# EasyEDA Pro project schematic.epro

# Schematic Occula Zero Control Board Teensy Rev 2
Board Name: Occula Zero Control Board Teensy Rev 2; Create Date: 2025-01-11; Page Name: P1; Project Name: Occula Zero Control Board v2; Schematic Name: Occula Zero Control Board Teensy Rev 2; Update Date: 2025-01-18; Company: EasyEDA.com; Page Size: A4; Version: V1.0
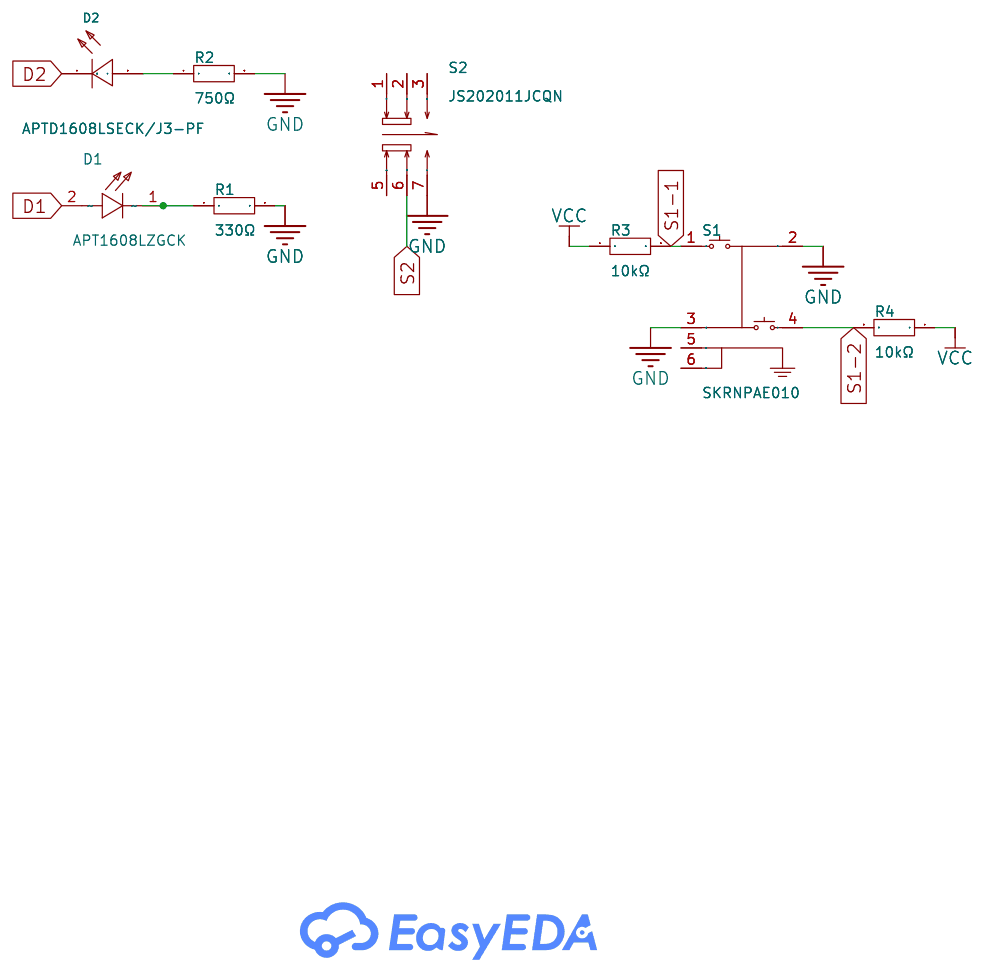
[diagram p0: schematic sheet]

## Parts
D1  APT1608LZGCK  [LED_APT1608LZGCK]
D2  APTD1608LSECK/J3-PF  [LED-SMD_L1.6-W0.8-RD]
R1  330Ω  [R0603]
R2  750Ω  [R0603]
R3  10kΩ  [R0603]
R4  10kΩ  [R0603]
S1  SKRNPAE010  [SW-SMD_6P-L6.0-W6.0-P4.50-LS6.4]
S2  JS202011JCQN  [SW-SMD_JS202011JCQN]

## Library data of the parts
D1 = APT1608LZGCK
D2 = APTD1608LSECK/J3-PF: Emitted Color:Red Forward Voltage (VF):1.8V Forward Voltage (VF):1.8V Forward Current:2mA Dominant Wavelength:625nm Dominant Wavelength:625nm Peak Wavelength:640nm Lens Color:无色透明透镜 Luminous Intensity:50mcd Luminous Intensity:50mcd Viewing Angle:60°; Supplier Part: C5879214; Manufacturer: Kingbright; Supplier Footprint: SMD,1.6x0.8mm; JLCPCB Part Class: Extended Part; Supplier: LCSC; Emitted Color: Red; Forward Voltage (VF): 1.8V; Forward Current: 2mA; Dominant Wavelength: 625nm; Peak Wavelength: 640nm; Lens Color: 无色透明透镜; Luminous Intensity: 50mcd; Viewing Angle: 60°
R1 = RC0603JR-07330RL: Type:Thick Film Resistors Resistance: Tolerance:±5% Tolerance:±5% Power(Watts): Overload Voltage (Max): Temperature Coefficient:±100ppm/℃ Temperature Coefficient:±100ppm/℃ Operating Temperature Range:-55℃~+155℃ Operating Temperature Range:-55℃~+155℃; LCSC Part Name: 厚膜电阻 330Ω ±5% 100mW; Supplier Part: C98220; Manufacturer: YAGEO(国巨); Supplier Footprint: 0603; JLCPCB Part Class: Extended Part; Datasheet: https://atta.szlcsc.com/upload/public/pdf/source/20170705/1499242708629.pdf; Supplier: LCSC; Type: Thick Film Resistors; Tolerance: ±5%; Temperature Coefficient: ±100ppm/℃; Operating Temperature Range: -55℃~+155℃
R2 = RC0603JR-07750RL: Type:Thick Film Resistors Resistance: Tolerance:±5% Tolerance:±5% Power(Watts): Overload Voltage (Max): Temperature Coefficient:±100ppm/℃ Temperature Coefficient:±100ppm/℃ Operating Temperature Range:-55℃~+155℃ Operating Temperature Range:-55℃~+155℃; LCSC Part Name: 厚膜电阻 750Ω ±5% 100mW; Supplier Part: C98220; Manufacturer: YAGEO(国巨); Supplier Footprint: 0603; JLCPCB Part Class: Extended Part; Datasheet: https://atta.szlcsc.com/upload/public/pdf/source/20180821/C275644_0D56F95EFF785E7D9A1FEF436B37DA78.pdf; Supplier: LCSC; Type: Thick Film Resistors; Tolerance: ±5%; Temperature Coefficient: ±100ppm/℃; Operating Temperature Range: -55℃~+155℃
R3 R4 = RC0603FR-0710KL: Type:Thick Film Resistors Resistance: Tolerance:±1% Tolerance:±1% Power(Watts): Overload Voltage (Max): Temperature Coefficient:±100ppm/℃ Temperature Coefficient:±100ppm/℃ Operating Temperature Range:-55℃~+155℃ Operating Temperature Range:-55℃~+155℃; LCSC Part Name: 厚膜电阻 10kΩ ±1% 100mW; Supplier Part: C98220; Manufacturer: YAGEO(国巨); Supplier Footprint: 0603; JLCPCB Part Class: Extended Part; Datasheet: https://atta.szlcsc.com/upload/public/pdf/source/20180927/C295883_E8D83085EA81BD7DE0B2B681138C15EE.pdf; Supplier: LCSC; Type: Thick Film Resistors; Tolerance: ±1%; Temperature Coefficient: ±100ppm/℃; Operating Temperature Range: -55℃~+155℃
S1 = SKRNPAE010: Circuit:Single Pole Double Throw (SPDT) Actuator Style:- Mounting Style:Standing paste Switch Length:6mm Switch Width:6mm Switch Height:0.9mm Contact Current:50mA Voltage Rating (DC):12V With Lamp:- Mechanical Life:-; LCSC Part Name: 6*6*0.9mm 立贴 轻触开关; Supplier Part: C202378; Manufacturer: ALPSALPINE(阿尔卑斯阿尔派); Supplier Footprint: SMD; JLCPCB Part Class: Extended Part; Datasheet: https://atta.szlcsc.com/upload/public/pdf/source/20180403/C202378_EA2E24D6F81A35F4A83E721B816219CC.pdf; Supplier: LCSC; Circuit: Single Pole Double Throw (SPDT); Mounting Style: Standing paste; Switch Length: 6mm; Switch Width: 6mm; Switch Height: 0.9mm; Contact Current: 50mA; Voltage Rating (DC): 12V
S2 = JS202011JCQN: Circuit:DPDT Actuator Style:Rectangular columnar Pin Style:J pin Switch Height:5.5mm Mounting Style:Brick nogging Current Rating (DC):300mA Voltage Rating (DC):6V Current Rating (AC):- Voltage Rating (AC):- Mechanical Life:5千次 Operating Temperature:-40℃~+; Supplier Part: C221665; Manufacturer: C&K; Supplier Footprint: SMD; JLCPCB Part Class: Extended Part; Datasheet: https://atta.szlcsc.com/upload/public/pdf/source/20180724/C221669_CAC5A84D68C57021DAEFEE02A0886173.pdf; Supplier: LCSC; Circuit: DPDT; Actuator Style: Rectangular columnar; Pin Style: J pin; Switch Height: 5.5mm; Mounting Style: Brick nogging; Current Rating (DC): 300mA; Voltage Rating (DC): 6V; Mechanical Life: 5千次; Operating Temperature: -40℃~+85℃

## Nets
GND: R1.2 R2.2 S1.2 S1.3 S2.7
VCC: R3.1 R4.1
D1: D1.2
D2: D2.1(C)
S1-1: R3.2 S1.1
S1-2: R4.2 S1.4
S2: S2.6
Net-(D1-1): D1.1 R1.1
Net-(D2-2): D2.2(A) R2.1

Not connected (* = marked no-connect by the designer): S1 5 6; S2 1 2 3 5
